# EAGLE schematic dac8_v2 (EAGLE 5.12)

## Sheet 1 of 2
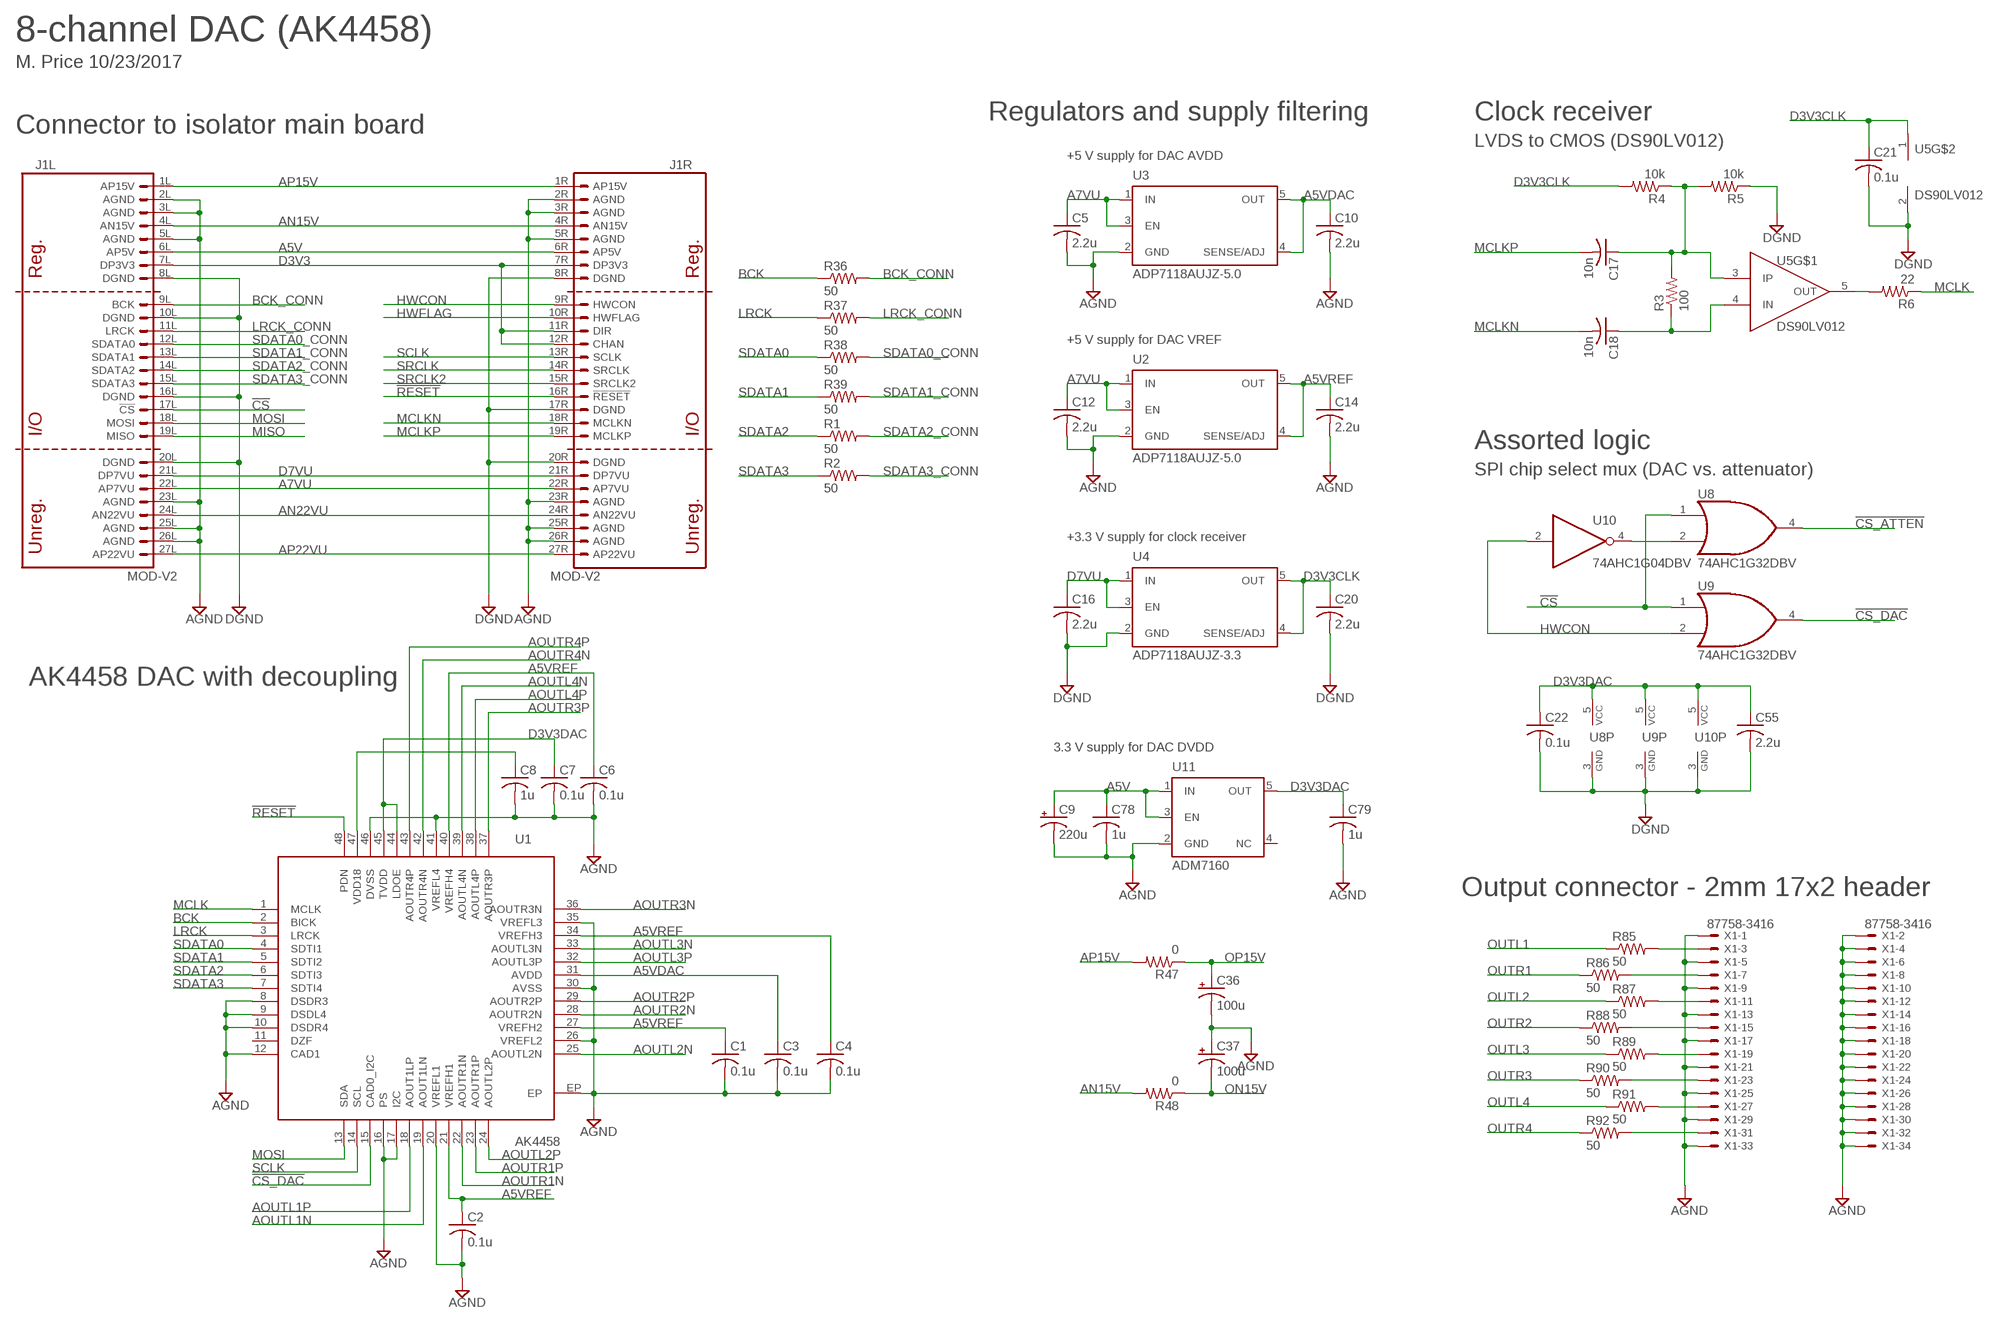
[diagram p0: schematic, sheet 1]

### Parts
C1  0.1u  C-USC0603  [C0603]
C2  0.1u  C-USC0603  [C0603]
C3  0.1u  C-USC0603  [C0603]
C4  0.1u  C-USC0603  [C0603]
C5  2.2u  C-USC0805  [C0805]
C6  0.1u  C-USC0603  [C0603]
C7  0.1u  C-USC0603  [C0603]
C8  1u  C-USC0603  [C0603]
C9  220u  CPOL-USE  [PANASONIC_E]
C10  2.2u  C-USC0805  [C0805]
C12  2.2u  C-USC0805  [C0805]
C14  2.2u  C-USC0805  [C0805]
C16  2.2u  C-USC0805  [C0805]
C17  10n  C-USC0603  [C0603]
C18  10n  C-USC0603  [C0603]
C20  2.2u  C-USC0805  [C0805]
C21  0.1u  C-USC0603  [C0603]
C22  0.1u  C-USC0603  [C0603]
C36  100u  CPOL-USE  [PANASONIC_E]
C37  100u  CPOL-USE  [PANASONIC_E]
C55  2.2u  C-USC0805  [C0805]
C78  1u  C-USC0603  [C0603]
C79  1u  C-USC0603  [C0603]
J1  MOD-V2  [MOD-V2]
R1  50  R-US_R0603  [R0603]
R2  50  R-US_R0603  [R0603]
R3  100  R-US_R0603  [R0603]
R4  10k  R-US_R0603  [R0603]
R5  10k  R-US_R0603  [R0603]
R6  22  R-US_R0603  [R0603]
R36  50  R-US_R0603  [R0603]
R37  50  R-US_R0603  [R0603]
R38  50  R-US_R0603  [R0603]
R39  50  R-US_R0603  [R0603]
R47  0  R-US_R0603  [R0603]
R48  0  R-US_R0603  [R0603]
R85  50  R-US_R0603  [R0603]
R86  50  R-US_R0603  [R0603]
R87  50  R-US_R0603  [R0603]
R88  50  R-US_R0603  [R0603]
R89  50  R-US_R0603  [R0603]
R90  50  R-US_R0603  [R0603]
R91  50  R-US_R0603  [R0603]
R92  50  R-US_R0603  [R0603]
U1  AK4458  [QFN48_EP_AKM]
U2  ADP7118AUJZ-5.0  ADP7118AUJZ  [SOT23-DBV]
U3  ADP7118AUJZ-5.0  ADP7118AUJZ  [SOT23-DBV]
U4  ADP7118AUJZ-3.3  ADP7118AUJZ  [SOT23-DBV]
U5  DS90LV012  [SOT23-DBV]
U8  74AHC1G32DBV  [SOT23-5]
U9  74AHC1G32DBV  [SOT23-5]
U10  74AHC1G04DBV  [SOT23-5]
U11  ADM7160  [SOT23-DBV]
X1  87758-3416  [87758-3416]

### Nets
!CS: J1.17L(L:!CS) U8.1(I0) U9.1(I0)
!CS_ATTEN: U8.4(O) ; also sheet 2
!CS_DAC: U1.15(CAD0_I2C) U9.4(O)
!RESET: J1.16R(R:!RESET) U1.48(PDN)
A5V: C9.+ C78.1 J1.6L(L:AP5V) J1.6R(R:AP5V) U11.1(IN) U11.3(EN) ; also sheet 2
A5VDAC: C3.1 C10.1 U1.31(AVDD) U3.4(SENSE/ADJ) U3.5(OUT)
A5VREF: C1.1 C2.1 C4.1 C6.1 C14.1 U1.21(VREFH1) U1.27(VREFH2) U1.34(VREFH3) U1.40(VREFH4) U2.4(SENSE/ADJ) U2.5(OUT)
A7VU: C5.1 C12.1 J1.22L(L:AP7VU) J1.22R(R:AP7VU) U2.1(IN) U2.3(EN) U3.1(IN) U3.3(EN)
AGND: C1.2 C2.2 C3.2 C4.2 C5.2 C6.2 C7.2 C8.2 C9.- C10.2 C12.2 C14.2 C36.- C37.+ C78.2 C79.2 J1.2L(L:AGND) J1.2R(R:AGND) J1.3L(L:AGND) J1.3R(R:AGND) J1.5L(L:AGND) J1.5R(R:AGND) J1.23L(L:AGND) J1.23R(R:AGND) J1.25L(L:AGND) J1.25R(R:AGND) J1.26L(L:AGND) J1.26R(R:AGND) U1.8(DSDR3) U1.9(DSDL4) U1.10(DSDR4) U1.12(CAD1) U1.16(PS) U1.17(I2C) U1.20(VREFL1) U1.26(VREFL2) U1.30(AVSS) U1.35(VREFL3) U1.41(VREFL4) U1.46(DVSS) U1.EP U2.2(GND) U3.2(GND) U11.2(GND) X1.1 X1.2 X1.4 X1.5 X1.6 X1.8 X1.9 X1.10 X1.12 X1.13 X1.14 X1.16 X1.17 X1.18 X1.20 X1.21 X1.22 X1.24 X1.25 X1.26 X1.28 X1.29 X1.30 X1.32 X1.33 X1.34 ; also sheet 2
AN15V: J1.4L(L:AN15V) J1.4R(R:AN15V) R48.2
AN22VU: J1.24L(L:AN22VU) J1.24R(R:AN22VU)
AOUTL1N: U1.19(AOUT1LN) ; also sheet 2
AOUTL1P: U1.18(AOUT1LP) ; also sheet 2
AOUTL2N: U1.25(AOUTL2N) ; also sheet 2
AOUTL2P: U1.24(AOUTL2P) ; also sheet 2
AOUTL3N: U1.33(AOUTL3N) ; also sheet 2
AOUTL3P: U1.32(AOUTL3P) ; also sheet 2
AOUTL4N: U1.39(AOUTL4N) ; also sheet 2
AOUTL4P: U1.38(AOUTL4P) ; also sheet 2
AOUTR1N: U1.22(AOUTR1N) ; also sheet 2
AOUTR1P: U1.23(AOUTR1P) ; also sheet 2
AOUTR2N: U1.28(AOUTR2N) ; also sheet 2
AOUTR2P: U1.29(AOUTR2P) ; also sheet 2
AOUTR3N: U1.36(AOUTR3N) ; also sheet 2
AOUTR3P: U1.37(AOUTR3P) ; also sheet 2
AOUTR4N: U1.42(AOUTR4N) ; also sheet 2
AOUTR4P: U1.43(AOUTR4P) ; also sheet 2
AP15V: J1.1L(L:AP15V) J1.1R(R:AP15V) R47.2
AP22VU: J1.27L(L:AP22VU) J1.27R(R:AP22VU)
BCK: R36.1 U1.2(BICK)
BCK_CONN: J1.9L(L:BCK) R36.2
D3V3: J1.7L(L:DP3V3) J1.7R(R:DP3V3) J1.11R(R:DIR) J1.12R(R:CHAN)
D3V3CLK: C20.1 C21.1 R4.2 U4.4(SENSE/ADJ) U4.5(OUT) U5.1(V+)
D3V3DAC: C7.1 C22.1 C55.1 C79.1 U1.44(LDOE) U1.45(TVDD) U8.5(VCC) U9.5(VCC) U10.5(VCC) U11.5(OUT) ; also sheet 2
D7VU: C16.1 J1.21L(L:DP7VU) J1.21R(R:DP7VU) U4.1(IN) U4.3(EN)
DGND: C16.2 C20.2 C21.2 C22.2 C55.2 J1.8L(L:DGND) J1.8R(R:DGND) J1.10L(L:DGND) J1.16L(L:DGND) J1.17R(R:DGND) J1.20L(L:DGND) J1.20R(R:DGND) R5.1 U4.2(GND) U5.2(V-) U8.3(GND) U9.3(GND) U10.3(GND)
HWCON: J1.9R(R:HWCON) U9.2(I1) U10.2(I)
HWFLAG: J1.10R(R:HWFLAG)
LRCK: R37.1 U1.3(LRCK)
LRCK_CONN: J1.11L(L:LRCK) R37.2
MCLK: R6.1 U1.1(MCLK)
MCLKN: C18.2 J1.18R(R:MCLKN)
MCLKP: C17.2 J1.19R(R:MCLKP)
MISO: J1.19L(L:MISO) ; also sheet 2
MOSI: J1.18L(L:MOSI) U1.13(SDA) ; also sheet 2
N$1: U8.2(I1) U10.4(O)
N$6: R85.2 X1.3
N$7: R86.2 X1.7
N$15: R87.2 X1.11
N$16: C17.1 R3.2 R4.1 R5.2 U5.3(IP)
N$17: R88.2 X1.15
N$20: C18.1 R3.1 U5.4(IN)
N$24: R6.2 U5.5(OUT)
N$28: R89.2 X1.19
N$29: R90.2 X1.23
N$37: R91.2 X1.27
N$38: R92.2 X1.31
ON15V: C37.- R48.1 ; also sheet 2
OP15V: C36.+ R47.1 ; also sheet 2
OUTL1: R85.1 ; also sheet 2
OUTL2: R87.1 ; also sheet 2
OUTL3: R89.1 ; also sheet 2
OUTL4: R91.1 ; also sheet 2
OUTR1: R86.1 ; also sheet 2
OUTR2: R88.1 ; also sheet 2
OUTR3: R90.1 ; also sheet 2
OUTR4: R92.1 ; also sheet 2
SCLK: J1.13R(R:SCLK) U1.14(SCL) ; also sheet 2
SDATA0: R38.1 U1.4(SDTI1)
SDATA0_CONN: J1.12L(L:SDATA0) R38.2
SDATA1: R39.1 U1.5(SDTI2)
SDATA1_CONN: J1.13L(L:SDATA1) R39.2
SDATA2: R1.1 U1.6(SDTI3)
SDATA2_CONN: J1.14L(L:SDATA2) R1.2
SDATA3: R2.1 U1.7(SDTI4)
SDATA3_CONN: J1.15L(L:SDATA3) R2.2
SRCLK: J1.14R(R:SRCLK)
SRCLK2: J1.15R(R:SRCLK2)
VDD18: C8.1 U1.47(VDD18)
Unconnected: U1.11(DZF) U11.4(NC)

### Notes on the sheet
- 8-channel DAC (AK4458)
- M. Price 10/23/2017
- Regulators and supply filtering | Clock receiver
- Connector to isolator main board
- LVDS to CMOS (DS90LV012)
- +5 V supply for DAC AVDD
- +5 V supply for DAC VREF
- Assorted logic
- SPI chip select mux (DAC vs. attenuator)
- +3.3 V supply for clock receiver
- AK4458 DAC with decoupling
- 3.3 V supply for DAC DVDD
- Output connector - 2mm 17x2 header

## Sheet 2 of 2
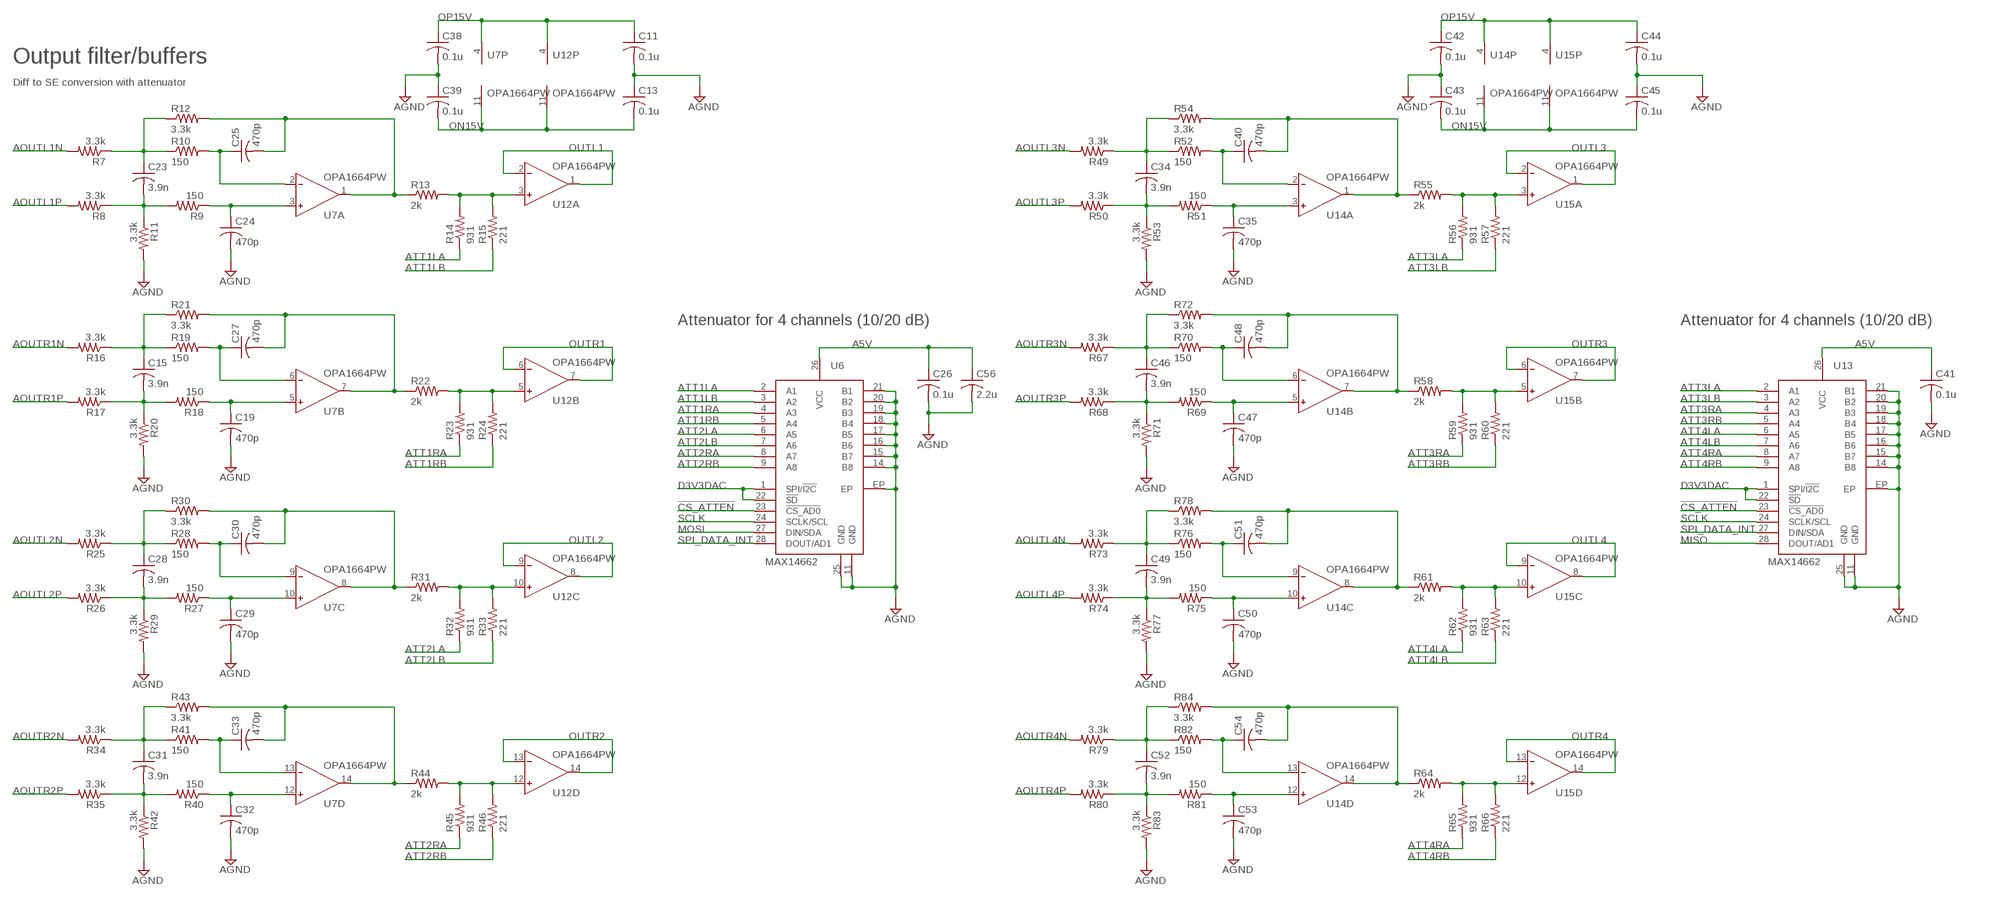
[diagram p1: schematic, sheet 2]

### Parts
C11  0.1u  C-USC0603  [C0603]
C13  0.1u  C-USC0603  [C0603]
C15  3.9n  C-USC0603  [C0603]
C19  470p  C-USC0603  [C0603]
C23  3.9n  C-USC0603  [C0603]
C24  470p  C-USC0603  [C0603]
C25  470p  C-USC0603  [C0603]
C26  0.1u  C-USC0603  [C0603]
C27  470p  C-USC0603  [C0603]
C28  3.9n  C-USC0603  [C0603]
C29  470p  C-USC0603  [C0603]
C30  470p  C-USC0603  [C0603]
C31  3.9n  C-USC0603  [C0603]
C32  470p  C-USC0603  [C0603]
C33  470p  C-USC0603  [C0603]
C34  3.9n  C-USC0603  [C0603]
C35  470p  C-USC0603  [C0603]
C38  0.1u  C-USC0603  [C0603]
C39  0.1u  C-USC0603  [C0603]
C40  470p  C-USC0603  [C0603]
C41  0.1u  C-USC0603  [C0603]
C42  0.1u  C-USC0603  [C0603]
C43  0.1u  C-USC0603  [C0603]
C44  0.1u  C-USC0603  [C0603]
C45  0.1u  C-USC0603  [C0603]
C46  3.9n  C-USC0603  [C0603]
C47  470p  C-USC0603  [C0603]
C48  470p  C-USC0603  [C0603]
C49  3.9n  C-USC0603  [C0603]
C50  470p  C-USC0603  [C0603]
C51  470p  C-USC0603  [C0603]
C52  3.9n  C-USC0603  [C0603]
C53  470p  C-USC0603  [C0603]
C54  470p  C-USC0603  [C0603]
C56  2.2u  C-USC0805  [C0805]
R7  3.3k  R-US_R0603  [R0603]
R8  3.3k  R-US_R0603  [R0603]
R9  150  R-US_R0603  [R0603]
R10  150  R-US_R0603  [R0603]
R11  3.3k  R-US_R0603  [R0603]
R12  3.3k  R-US_R0603  [R0603]
R13  2k  R-US_R0603  [R0603]
R14  931  R-US_R0603  [R0603]
R15  221  R-US_R0603  [R0603]
R16  3.3k  R-US_R0603  [R0603]
R17  3.3k  R-US_R0603  [R0603]
R18  150  R-US_R0603  [R0603]
R19  150  R-US_R0603  [R0603]
R20  3.3k  R-US_R0603  [R0603]
R21  3.3k  R-US_R0603  [R0603]
R22  2k  R-US_R0603  [R0603]
R23  931  R-US_R0603  [R0603]
R24  221  R-US_R0603  [R0603]
R25  3.3k  R-US_R0603  [R0603]
R26  3.3k  R-US_R0603  [R0603]
R27  150  R-US_R0603  [R0603]
R28  150  R-US_R0603  [R0603]
R29  3.3k  R-US_R0603  [R0603]
R30  3.3k  R-US_R0603  [R0603]
R31  2k  R-US_R0603  [R0603]
R32  931  R-US_R0603  [R0603]
R33  221  R-US_R0603  [R0603]
R34  3.3k  R-US_R0603  [R0603]
R35  3.3k  R-US_R0603  [R0603]
R40  150  R-US_R0603  [R0603]
R41  150  R-US_R0603  [R0603]
R42  3.3k  R-US_R0603  [R0603]
R43  3.3k  R-US_R0603  [R0603]
R44  2k  R-US_R0603  [R0603]
R45  931  R-US_R0603  [R0603]
R46  221  R-US_R0603  [R0603]
R49  3.3k  R-US_R0603  [R0603]
R50  3.3k  R-US_R0603  [R0603]
R51  150  R-US_R0603  [R0603]
R52  150  R-US_R0603  [R0603]
R53  3.3k  R-US_R0603  [R0603]
R54  3.3k  R-US_R0603  [R0603]
R55  2k  R-US_R0603  [R0603]
R56  931  R-US_R0603  [R0603]
R57  221  R-US_R0603  [R0603]
R58  2k  R-US_R0603  [R0603]
R59  931  R-US_R0603  [R0603]
R60  221  R-US_R0603  [R0603]
R61  2k  R-US_R0603  [R0603]
R62  931  R-US_R0603  [R0603]
R63  221  R-US_R0603  [R0603]
R64  2k  R-US_R0603  [R0603]
R65  931  R-US_R0603  [R0603]
R66  221  R-US_R0603  [R0603]
R67  3.3k  R-US_R0603  [R0603]
R68  3.3k  R-US_R0603  [R0603]
R69  150  R-US_R0603  [R0603]
R70  150  R-US_R0603  [R0603]
R71  3.3k  R-US_R0603  [R0603]
R72  3.3k  R-US_R0603  [R0603]
R73  3.3k  R-US_R0603  [R0603]
R74  3.3k  R-US_R0603  [R0603]
R75  150  R-US_R0603  [R0603]
R76  150  R-US_R0603  [R0603]
R77  3.3k  R-US_R0603  [R0603]
R78  3.3k  R-US_R0603  [R0603]
R79  3.3k  R-US_R0603  [R0603]
R80  3.3k  R-US_R0603  [R0603]
R81  150  R-US_R0603  [R0603]
R82  150  R-US_R0603  [R0603]
R83  3.3k  R-US_R0603  [R0603]
R84  3.3k  R-US_R0603  [R0603]
U6  MAX14662  [QFN28]
U7  OPA1664PW  ADA4692-4RU  [TSSOP14]
U12  OPA1664PW  ADA4692-4RU  [TSSOP14]
U13  MAX14662  [QFN28]
U14  OPA1664PW  ADA4692-4RU  [TSSOP14]
U15  OPA1664PW  ADA4692-4RU  [TSSOP14]

### Nets
!CS_ATTEN: U6.23(!CS_AD0) U13.23(!CS_AD0) ; also sheet 1
A5V: C26.1 C41.1 C56.1 U6.26(VCC) U13.26(VCC) ; also sheet 1
AGND: C11.2 C13.1 C19.2 C24.2 C26.2 C29.2 C32.2 C35.2 C38.2 C39.1 C41.2 C42.2 C43.1 C44.2 C45.1 C47.2 C50.2 C53.2 C56.2 R11.2 R20.2 R29.2 R42.2 R53.2 R71.2 R77.2 R83.2 U6.11(GND) U6.14(B8) U6.15(B7) U6.16(B6) U6.17(B5) U6.18(B4) U6.19(B3) U6.20(B2) U6.21(B1) U6.25(GND) U6.EP U13.11(GND) U13.14(B8) U13.15(B7) U13.16(B6) U13.17(B5) U13.18(B4) U13.19(B3) U13.20(B2) U13.21(B1) U13.25(GND) U13.EP ; also sheet 1
AOUTL1N: R7.2 ; also sheet 1
AOUTL1P: R8.2 ; also sheet 1
AOUTL1SE: C25.2 R12.2 R13.1 U7.1(A:OUT)
AOUTL1SE1: C40.2 R54.2 R55.1 U14.1(A:OUT)
AOUTL1SE2: C48.2 R58.1 R72.2 U14.7(B:OUT)
AOUTL1SE3: C51.2 R61.1 R78.2 U14.8(C:OUT)
AOUTL1SE4: C27.2 R21.2 R22.1 U7.7(B:OUT)
AOUTL1SE5: C30.2 R30.2 R31.1 U7.8(C:OUT)
AOUTL1SE6: C33.2 R43.2 R44.1 U7.14(D:OUT)
AOUTL1SE7: C54.2 R64.1 R84.2 U14.14(D:OUT)
AOUTL2N: R25.2 ; also sheet 1
AOUTL2P: R26.2 ; also sheet 1
AOUTL3N: R49.2 ; also sheet 1
AOUTL3P: R50.2 ; also sheet 1
AOUTL4N: R73.2 ; also sheet 1
AOUTL4P: R74.2 ; also sheet 1
AOUTR1N: R16.2 ; also sheet 1
AOUTR1P: R17.2 ; also sheet 1
AOUTR2N: R34.2 ; also sheet 1
AOUTR2P: R35.2 ; also sheet 1
AOUTR3N: R67.2 ; also sheet 1
AOUTR3P: R68.2 ; also sheet 1
AOUTR4N: R79.2 ; also sheet 1
AOUTR4P: R80.2 ; also sheet 1
ATT1LA: R14.1 U6.2(A1)
ATT1LB: R15.1 U6.3(A2)
ATT1RA: R23.1 U6.4(A3)
ATT1RB: R24.1 U6.5(A4)
ATT2LA: R32.1 U6.6(A5)
ATT2LB: R33.1 U6.7(A6)
ATT2RA: R45.1 U6.8(A7)
ATT2RB: R46.1 U6.9(A8)
ATT3LA: R56.1 U13.2(A1)
ATT3LB: R57.1 U13.3(A2)
ATT3RA: R59.1 U13.4(A3)
ATT3RB: R60.1 U13.5(A4)
ATT4LA: R62.1 U13.6(A5)
ATT4LB: R63.1 U13.7(A6)
ATT4RA: R65.1 U13.8(A7)
ATT4RB: R66.1 U13.9(A8)
D3V3DAC: U6.1(SPI/!I2C) U6.22(!SD) U13.1(SPI/!I2C) U13.22(!SD) ; also sheet 1
MISO: U13.28(DOUT/AD1) ; also sheet 1
MOSI: U6.27(DIN/SDA) ; also sheet 1
N$2: C23.1 R7.1 R10.1 R12.1
N$3: C23.2 R8.1 R9.2 R11.1
N$4: C24.1 R9.1 U7.3(A:IN+)
N$5: C25.1 R10.2 U7.2(A:IN-)
N$8: R13.2 R14.2 R15.2 U12.3(A:IN+)
N$11: C34.1 R49.1 R52.1 R54.1
N$12: C34.2 R50.1 R51.2 R53.1
N$13: C35.1 R51.1 U14.3(A:IN+)
N$14: C40.1 R52.2 U14.2(A:IN-)
N$18: R55.2 R56.2 R57.2 U15.3(A:IN+)
N$22: R58.2 R59.2 R60.2 U15.5(B:IN+)
N$23: C15.1 R16.1 R19.1 R21.1
N$25: C15.2 R17.1 R18.2 R20.1
N$26: C19.1 R18.1 U7.5(B:IN+)
N$27: C27.1 R19.2 U7.6(B:IN-)
N$30: R22.2 R23.2 R24.2 U12.5(B:IN+)
N$31: R61.2 R62.2 R63.2 U15.10(C:IN+)
N$32: R64.2 R65.2 R66.2 U15.12(D:IN+)
N$33: C28.1 R25.1 R28.1 R30.1
N$34: C28.2 R26.1 R27.2 R29.1
N$35: C29.1 R27.1 U7.10(C:IN+)
N$36: C30.1 R28.2 U7.9(C:IN-)
N$39: R31.2 R32.2 R33.2 U12.10(C:IN+)
N$40: C46.1 R67.1 R70.1 R72.1
N$41: C46.2 R68.1 R69.2 R71.1
N$42: C31.1 R34.1 R41.1 R43.1
N$43: C31.2 R35.1 R40.2 R42.1
N$44: C32.1 R40.1 U7.12(D:IN+)
N$45: C33.1 R41.2 U7.13(D:IN-)
N$46: C47.1 R69.1 U14.5(B:IN+)
N$47: C48.1 R70.2 U14.6(B:IN-)
N$50: R44.2 R45.2 R46.2 U12.12(D:IN+)
N$53: C49.1 R73.1 R76.1 R78.1
N$54: C49.2 R74.1 R75.2 R77.1
N$55: C50.1 R75.1 U14.10(C:IN+)
N$56: C51.1 R76.2 U14.9(C:IN-)
N$59: C52.1 R79.1 R82.1 R84.1
N$60: C52.2 R80.1 R81.2 R83.1
N$61: C53.1 R81.1 U14.12(D:IN+)
N$62: C54.1 R82.2 U14.13(D:IN-)
ON15V: C13.2 C39.2 C43.2 C45.2 U7.11(P:V-) U12.11(P:V-) U14.11(P:V-) U15.11(P:V-) ; also sheet 1
OP15V: C11.1 C38.1 C42.1 C44.1 U7.4(P:V+) U12.4(P:V+) U14.4(P:V+) U15.4(P:V+) ; also sheet 1
OUTL1: U12.1(A:OUT) U12.2(A:IN-) ; also sheet 1
OUTL2: U12.8(C:OUT) U12.9(C:IN-) ; also sheet 1
OUTL3: U15.1(A:OUT) U15.2(A:IN-) ; also sheet 1
OUTL4: U15.8(C:OUT) U15.9(C:IN-) ; also sheet 1
OUTR1: U12.6(B:IN-) U12.7(B:OUT) ; also sheet 1
OUTR2: U12.13(D:IN-) U12.14(D:OUT) ; also sheet 1
OUTR3: U15.6(B:IN-) U15.7(B:OUT) ; also sheet 1
OUTR4: U15.13(D:IN-) U15.14(D:OUT) ; also sheet 1
SCLK: U6.24(SCLK/SCL) U13.24(SCLK/SCL) ; also sheet 1
SPI_DATA_INT: U6.28(DOUT/AD1) U13.27(DIN/SDA)

### Notes on the sheet
- Output filter/buffers
- Diff to SE conversion with attenuator
- Attenuator for 4 channels (10/20 dB) | Attenuator for 4 channels (10/20 dB)

## Library data of the parts
C1-C8 C10-C35 C38-C56 C78 C79 = rcl:C-US: CAPACITOR, American symbol
C9 C36 C37 = rcl:CPOL-US: POLARIZED CAPACITOR, American symbol
J1 = cdp:MOD-V2
R1-R92 = rcl:R-US_: RESISTOR, American symbol
U1 = cdp:AK4458
U2-U4 = cdp:ADP7118
U5 = cdp:DS90LV012
U6 U13 = cdp:MAX14662
U7 U12 U14 U15 = analog-devices:ADA4692-4: Low Power, 3.6 MHz, Low Noise, Rail-to-Rail Output, Operational Amplifiers Source: http://www.analog.com/static/imported-files/data_sheets/ADA4691-2_4692-2_4692-4.pdf; MPN: ADA4692-4ARUZ; OC_FARNELL: 1827393; OC_NEWARK: 80R8154
U8 U9 = 74xx-little-us:74*1G32: 2-input OR gate
U10 = 74xx-little-us:74*1G04: INVERTER Gate
U11 = cdp:ADM7160
X1 = con-molex:87758-3416: 34 Pin - 2mm Dual Row Single Wafer, Vertical T/H HDR Source: http://www.molex.com/pdm_docs/sd/877580616_sd.pdf; MPN: 87758-3416; OC_FARNELL: unknown; OC_NEWARK: 25M5686